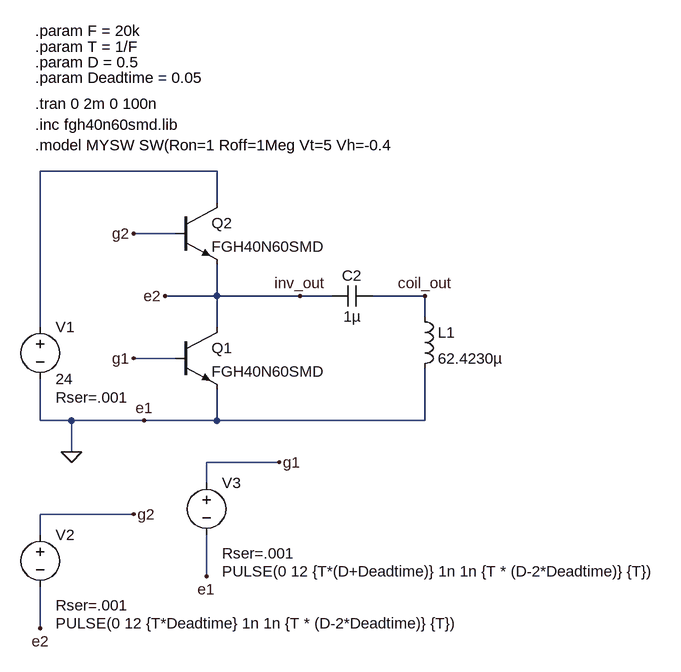
[diagram p0: schematic nonideal_resonant_inverter.asc]
nonideal_resonant_inverter.asc, the LTspice schematic file:
Version 4
SHEET 1 1764 820
WIRE 320 0 48 0
WIRE 320 48 320 0
WIRE 256 96 192 96
WIRE 320 192 320 144
WIRE 320 192 240 192
WIRE 448 192 320 192
WIRE 496 192 448 192
WIRE 640 192 560 192
WIRE 640 224 640 192
WIRE 48 240 48 0
WIRE 320 240 320 192
WIRE 256 288 192 288
WIRE 48 384 48 320
WIRE 96 384 48 384
WIRE 208 384 96 384
WIRE 320 384 320 336
WIRE 320 384 208 384
WIRE 640 384 640 304
WIRE 640 384 320 384
WIRE 96 432 96 384
WIRE 416 448 304 448
WIRE 304 480 304 448
WIRE 192 528 48 528
WIRE 48 560 48 528
WIRE 304 624 304 560
WIRE 48 704 48 640
FLAG 192 96 g2
FLAG 192 528 g2
FLAG 416 448 g1
FLAG 448 192 inv_out
FLAG 240 192 e2
FLAG 640 192 coil_out
FLAG 208 384 e1
FLAG 96 432 0
FLAG 192 288 g1
FLAG 304 624 e1
FLAG 48 704 e2
SYMBOL cap 560 176 R90
WINDOW 0 0 32 VBottom 2
WINDOW 3 32 32 VTop 2
SYMATTR InstName C2
SYMATTR Value 1µ
SYMBOL ind 624 208 R0
SYMATTR InstName L1
SYMATTR Value 62.4230µ
SYMATTR SpiceLine Rser=7
SYMBOL voltage 48 544 R0
WINDOW 3 24 152 Left 2
WINDOW 123 0 0 Left 0
WINDOW 39 24 124 Left 2
SYMATTR Value PULSE(0 12 {T*Deadtime} 1n 1n {T * (D-2*Deadtime)} {T})
SYMATTR SpiceLine Rser=.001
SYMATTR InstName V2
SYMBOL voltage 304 464 R0
WINDOW 3 24 152 Left 2
WINDOW 123 0 0 Left 0
WINDOW 39 24 124 Left 2
SYMATTR Value PULSE(0 12 {T*(D+Deadtime)} 1n 1n {T * (D-2*Deadtime)} {T})
SYMATTR SpiceLine Rser=.001
SYMATTR InstName V3
SYMBOL voltage 48 224 R0
WINDOW 123 0 0 Left 0
WINDOW 39 24 124 Left 2
SYMATTR SpiceLine Rser=.001
SYMATTR InstName V1
SYMATTR Value 24
SYMBOL npn 256 240 R0
SYMATTR InstName Q1
SYMATTR Value FGH40N60SMD
SYMATTR Prefix X
SYMBOL npn 256 48 R0
SYMATTR InstName Q2
SYMATTR Value FGH40N60SMD
SYMATTR Prefix X
TEXT 40 -72 Left 2 !.inc fgh40n60smd.lib
TEXT 40 -104 Left 2 !.tran 0 2m 0 100n
TEXT 40 -192 Left 2 !.param T = 1/F
TEXT 40 -216 Left 2 !.param F = 20k
TEXT 40 -168 Left 2 !.param D = 0.5
TEXT 40 -40 Left 2 !.model MYSW SW(Ron=1 Roff=1Meg Vt=5 Vh=-0.4
TEXT 40 -144 Left 2 !.param Deadtime = 0.05

The netlist it stands for:
* nonideal_resonant_inverter.asc
C2 coil_out e2 1µ
L1 coil_out 0 62.4230µ Rser=7
V2 g2 e2 PULSE(0 12 {T*Deadtime} 1n 1n {T * (D-2*Deadtime)} {T}) Rser=.001
V3 g1 0 PULSE(0 12 {T*(D+Deadtime)} 1n 1n {T * (D-2*Deadtime)} {T}) Rser=.001
V1 N001 0 24 Rser=.001
XQ1 e2 g1 0 FGH40N60SMD  ; pins C B E
XQ2 N001 g2 e2 FGH40N60SMD  ; pins C B E
.inc fgh40n60smd.lib
.tran 0 2m 0 100n
.param T = 1/F
.param F = 20k
.param D = 0.5
.model MYSW SW(Ron=1 Roff=1Meg Vt=5 Vh=-0.4
.param Deadtime = 0.05
.backanno
.end